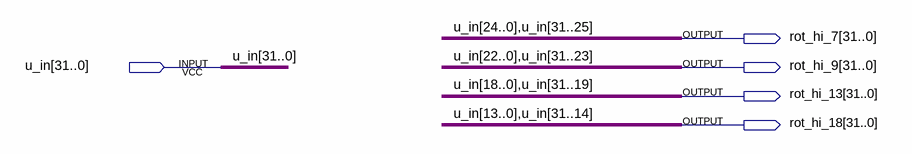
[diagram p0: schematic sheet]
// Quartus schematic shift.bdf as structural Verilog: 0 symbols, 5 pins
module shift (
  input  [31:0] u_in,
  output [31:0] rot_hi_7,
  output [31:0] rot_hi_9,
  output [31:0] rot_hi_13,
  output [31:0] rot_hi_18
);


  assign rot_hi_7 = {u_in[24:0], u_in[31:25]};
  assign rot_hi_9 = {u_in[22:0], u_in[31:23]};
  assign rot_hi_13 = {u_in[18:0], u_in[31:19]};
  assign rot_hi_18 = {u_in[13:0], u_in[31:14]};
endmodule
